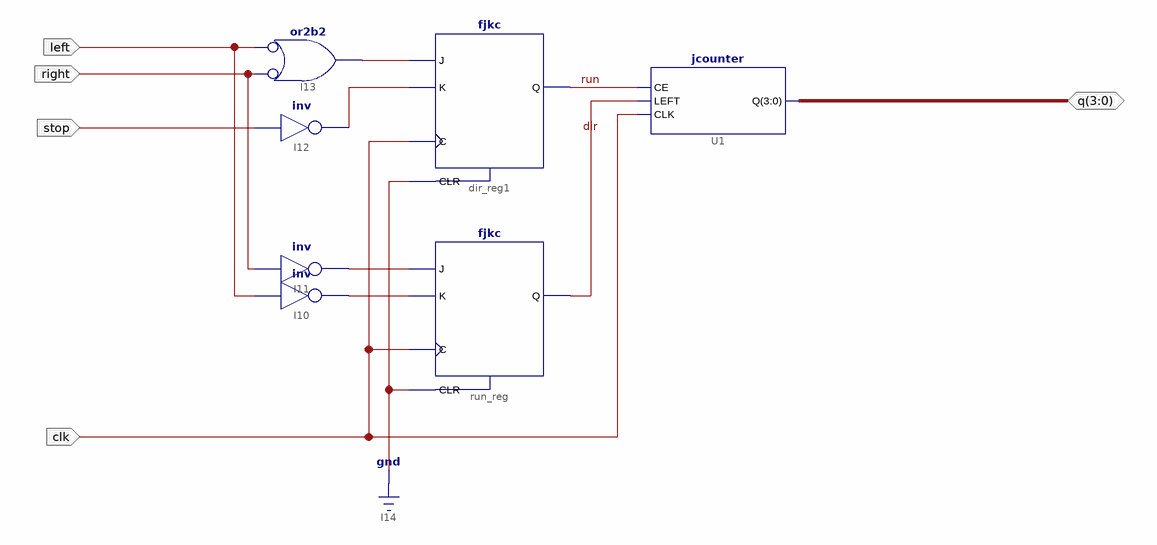
[diagram p0: schematic sheet 1]
// Xilinx ISE schematic jc2_top.sch (xc9500xl) as structural Verilog: 7 symbols, 5 ports
module jc2_top (
  input  clk,
  input  stop,
  input  left,
  input  right,
  inout  [3:0] q
);

  wire dir, run, XLXN_17, XLXN_18, XLXN_19, XLXN_20;

  not I10 (XLXN_17, left);
  not I11 (XLXN_18, right);
  not I12 (XLXN_19, stop);
  or I13 (XLXN_20, ~right, ~left);  // or2b2
  fjkc run_reg (.C(clk), .CLR(1'b0), .J(XLXN_18), .K(XLXN_17), .Q(dir));
  fjkc dir_reg1 (.C(clk), .CLR(1'b0), .J(XLXN_20), .K(XLXN_19), .Q(run));
  jcounter U1 (.CE(run), .CLK(clk), .LEFT(dir), .Q(q));
endmodule
